# Altium schematic sheet signal.SchDoc
size A4
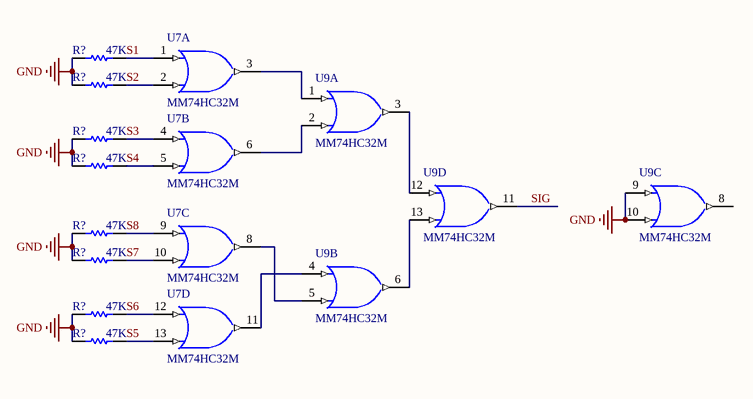
[diagram p0: signal.SchDoc]

## Parts
(Parts that share a designator on the sheet are numbered #1, #2 ... from top to bottom, then left to right.)
R?#1  value 47K  [0603]  (hidden comment: Res1)
R?#2  value 47K  [0603]  (hidden comment: Res1)
R?#3  value 47K  [0603]  (hidden comment: Res1)
R?#4  value 47K  [0603]  (hidden comment: Res1)
R?#5  value 47K  [0603]  (hidden comment: Res1)
R?#6  value 47K  [0603]  (hidden comment: Res1)
R?#7  value 47K  [0603]  (hidden comment: Res1)
R?#8  value 47K  [0603]  (hidden comment: Res1)
U7  MM74HC32M  [M14A_N]  (parts A,B,C,D of 4)
U9  MM74HC32M  [M14A_N]  (parts A,B,C,D of 4)

## Nets
+5V: U7.14(VCC) U9.14(VCC)
GND: R?#1.1 R?#2.1 R?#3.1 R?#4.1 R?#5.1 R?#6.1 R?#7.1 R?#8.1 U7.7(GND) U9.7(GND) U9.9(A) U9.10(B)
S1: R?#1.2 U7.1(A)
S2: R?#2.2 U7.2(B)
S3: R?#3.2 U7.4(A)
S4: R?#4.2 U7.5(B)
S5: R?#8.2 U7.13(B)
S6: R?#7.2 U7.12(A)
S7: R?#6.2 U7.10(B)
S8: R?#5.2 U7.9(A)
SIG: U9.11(Y)
NetU7_3: U7.3(Y) U9.1(A)
NetU7_6: U7.6(Y) U9.2(B)
NetU7_8: U7.8(Y) U9.5(B)
NetU7_11: U7.11(Y) U9.4(A)
NetU9_3: U9.3(Y) U9.12(A)
NetU9_6: U9.6(Y) U9.13(B)

Not connected (* = marked no-connect by the designer): U9 8(Y)

## Library data of the parts
R?#1-R?#8 = Res1: Resistor; Published: 8-Jun-2000; LatestRevisionDate: 17-Jul-2002; LatestRevisionNote: Re-released for DXP Platform.; PackageReference: AXIAL-0.3; Publisher: Altium Limited
U7 U9 = MM74HC32M: Quad 2-Input OR Gate; Published: 15-Apr-2002; LatestRevisionDate: 13-Apr-2006; LatestRevisionNote: IPC-7351 Footprint Added.; DatasheetVersion: 1988; PackageVersion: 2000; PackageReference: M14A; Publisher: Altium Limited; PackageDescription: 14-Pin Small Outline Integrated Circuit 1.27 mm Pitch; Code_IPC: SOIC127P600-14; ComponentLink1Description: Manufacturer Link; ComponentLink1URL: http://www.national.com/; ComponentLink2Description: Datasheet; ComponentLink2URL: http://www.fairchildsemi.com/ds/MM/MM74HC32.pdf; ComponentLink3Description: URL Link1; ComponentLink3URL: http://www.fairchildsemi.com/pf/MM/MM74HC32.html